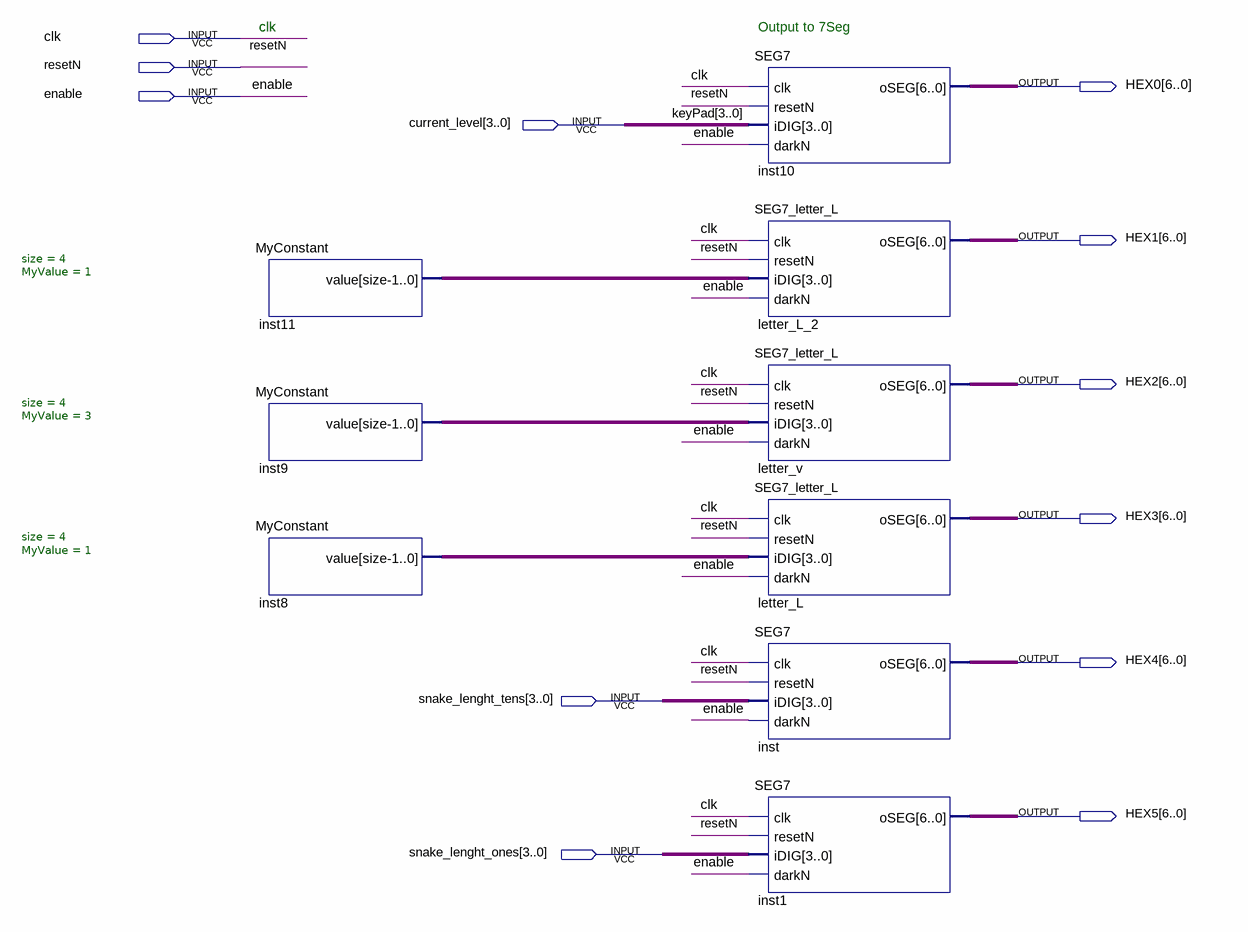
[diagram p0: schematic sheet]
// Quartus schematic ALL_HEXSS.bdf as structural Verilog: 9 symbols, 12 pins
module ALL_HEXSS (
  input  clk,
  input  resetN,
  input  enable,
  input  [3:0] current_level,
  input  [3:0] snake_lenght_tens,
  input  [3:0] snake_lenght_ones,
  output [6:0] HEX0,
  output [6:0] HEX1,
  output [6:0] HEX2,
  output [6:0] HEX3,
  output [6:0] HEX4,
  output [6:0] HEX5
);

  wire [3:0] inst8_value, inst9_value, inst11_value;

  MyConstant #(.size(4), .MyValue(1)) inst11 (.value(inst11_value));
  MyConstant #(.size(4), .MyValue(3)) inst9 (.value(inst9_value));
  MyConstant #(.size(4), .MyValue(1)) inst8 (.value(inst8_value));
  SEG7 inst10 (.clk(clk), .resetN(resetN), .iDIG(current_level), .darkN(enable), .oSEG(HEX0));
  SEG7_letter_L letter_L_2 (.clk(clk), .resetN(resetN), .iDIG(inst11_value), .darkN(enable), .oSEG(HEX1));
  SEG7_letter_L letter_v (.clk(clk), .resetN(resetN), .iDIG(inst9_value), .darkN(enable), .oSEG(HEX2));
  SEG7_letter_L letter_L (.clk(clk), .resetN(resetN), .iDIG(inst8_value), .darkN(enable), .oSEG(HEX3));
  SEG7 inst (.clk(clk), .resetN(resetN), .iDIG(snake_lenght_tens), .darkN(enable), .oSEG(HEX4));
  SEG7 inst1 (.clk(clk), .resetN(resetN), .iDIG(snake_lenght_ones), .darkN(enable), .oSEG(HEX5));

  // Other names for the same wires on the sheet: keyPad[3:0] = current_level

  // Notes on the sheet:
  //   clk
  //   Output to 7Seg
endmodule
